# Altium schematic sheet 02_Power_Supply.SchDoc
size A4
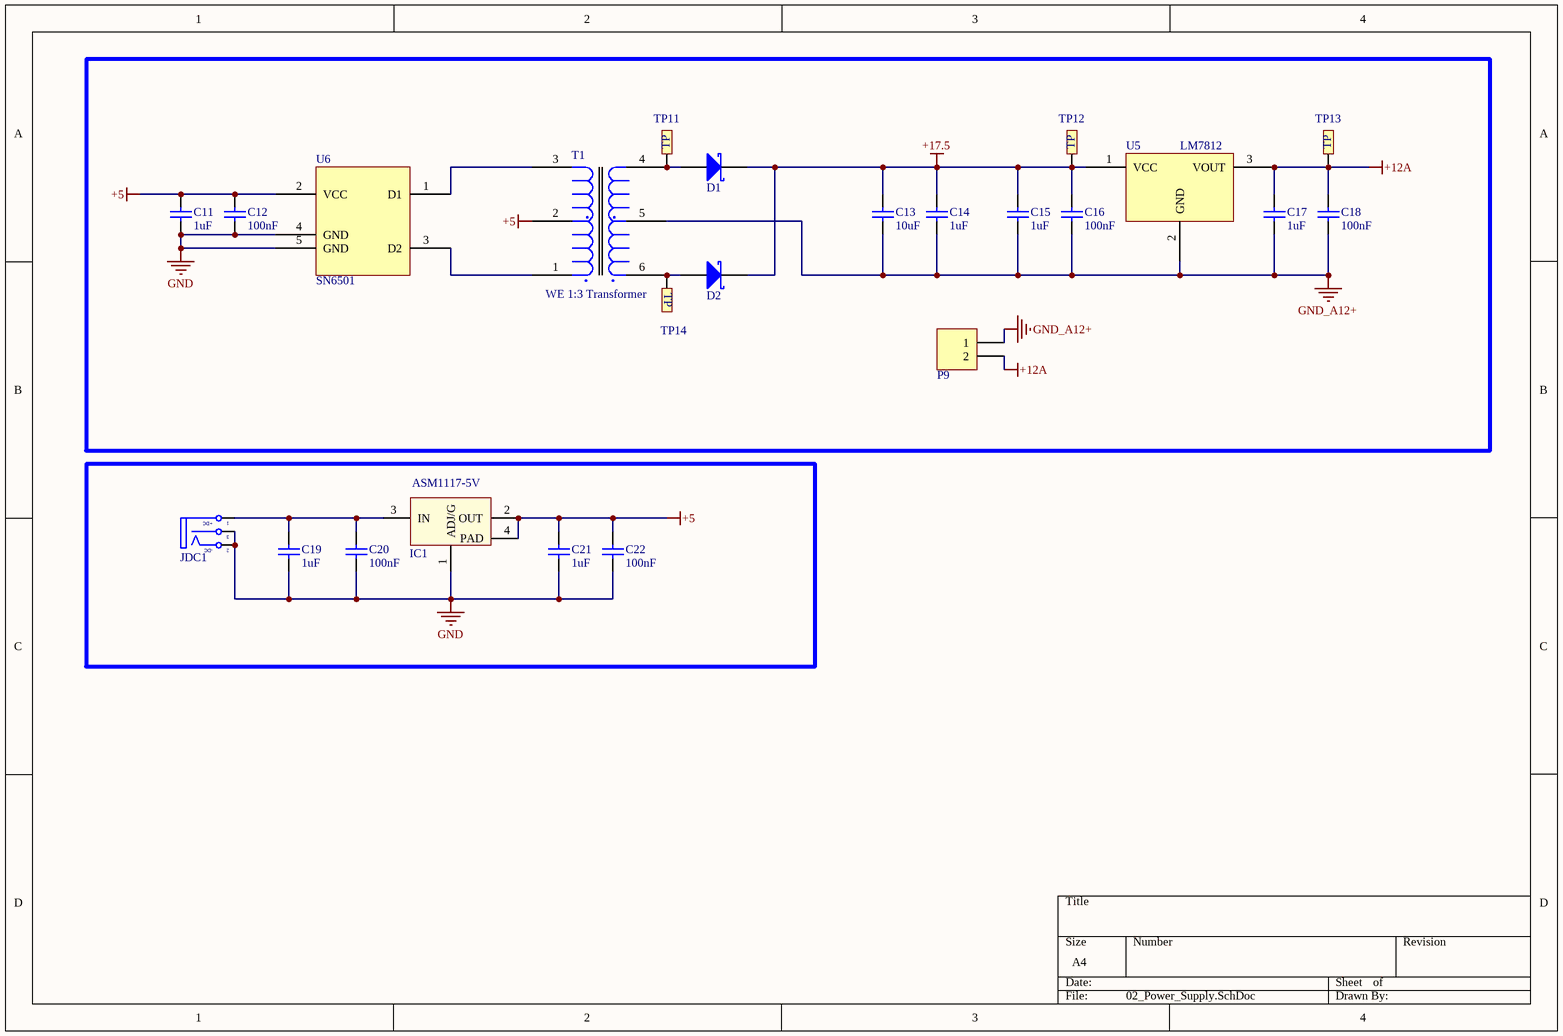
[diagram p0: 02_Power_Supply.SchDoc]

## Parts
C11  value 1uF  [CAP-SM-0805]  (hidden comment: Cap Non-Pol SMD)
C12  value 100nF  [CAP-SM-0805]  (hidden comment: Cap Non-Pol SMD)
C13  value 10uF  [CAP-SM-0805]  (hidden comment: Cap Non-Pol SMD)
C14  value 1uF  [CAP-SM-0805]  (hidden comment: Cap Non-Pol SMD)
C15  value 1uF  [CAP-SM-0805]  (hidden comment: Cap Non-Pol SMD)
C16  value 100nF  [CAP-SM-0805]  (hidden comment: Cap Non-Pol SMD)
C17  value 1uF  [CAP-SM-0805]  (hidden comment: Cap Non-Pol SMD)
C18  value 100nF  [CAP-SM-0805]  (hidden comment: Cap Non-Pol SMD)
C19  value 1uF  [CAP-SM-0805]  (hidden comment: Cap Non-Pol SMD)
C20  value 100nF  [CAP-SM-0805]  (hidden comment: Cap Non-Pol SMD)
C21  value 1uF  [CAP-SM-0805]  (hidden comment: Cap Non-Pol SMD)
C22  value 100nF  [CAP-SM-0805]  (hidden comment: Cap Non-Pol SMD)
D1  D Schottky  [SS34]  (value not drawn)
D2  D Schottky  [SS34]  (value not drawn)
IC1  ASM1117-5V  [SOT223-4N]
JDC1  Jack DC  [DC-IN]  (value not drawn)
P9  Domino 2  [DOMINO 2- 5mm]  (value not drawn)
T1  WE 1:3 Transformer  [750316818]
TP11  Test Point  [TP]  (value not drawn)
TP12  Test Point  [TP]  (value not drawn)
TP13  Test Point  [TP]  (value not drawn)
TP14  Test Point  [TP]  (value not drawn)
U5  LM7812  [DPAK228P1014X239-3N]
U6  SN6501  [SOT95P280X145-5N]

## Nets
+5: C11.2 C12.2 C21.2 C22.2 IC1.2(OUT) IC1.4(PAD) T1.2 U6.2(VCC)
+12A: C17.2 C18.2 P9.2 TP13.TP1 U5.3(VOUT)
+17.5: C13.2 C14.2 C15.2 C16.2 D1.2(K) D2.2(K) TP12.TP1 U5.1(VCC)
GND: C11.1 C12.1 C19.1 C20.1 C21.1 C22.1 IC1.1(ADJ/G) JDC1.2(TN) JDC1.3(S) U6.4(GND) U6.5(GND)
GND_A12+: C13.1 C14.1 C15.1 C16.1 C17.1 C18.1 P9.1 T1.5 U5.2(GND)
NetC19_2: C19.2 C20.2 IC1.3(IN) JDC1.1(T)
NetD1_1: D1.1(A) T1.4 TP11.TP1
NetD2_1: D2.1(A) T1.6 TP14.TP1
NetT1_1: T1.1 U6.3(D2)
NetT1_3: T1.3 U6.1(D1)

## Notes on the sheet
- (in symbol Jack DC) +DC; -DC
- (in symbol Test Point) TP

## Library data of the parts
C11-C22 = Cap Non-Pol SMD: Capacitor
D1 D2 = D Schottky: Schottky Diode; Published: 8-Jun-2000; LatestRevisionDate: 17-Jul-2002; LatestRevisionNote: Re-released for DXP Platform.; PackageReference: SMB; Publisher: Altium Limited; PackageDescription: DO-214-AA/SMB; 2 C-Bend Leads; Body 5.3 x 3.6 mm, inc. leads (LxW); Code_JEDEC: DO-214-AA
IC1 = LM1117: Available in 1.8V, 2.5V, 2.85V, 3.3V, 5V, and  Adjustable Versions; Value: LM317
JDC1 = Jack DC: Jack DC input; Value: Jac DC
P9 = Domino 2: Domino, 2-Pin; LatestRevisionDate: 17-Jul-2002; LatestRevisionNote: Re-released for DXP Platform.; Publisher: Altium Limited
T1 = WE 1:3.5 Transformer: Manufacturer: Wurth Elektronik; ComponentLink1Description: Supplier 1 Link; ComponentLink1URL: https://www.mouser.vn/ProductDetail/Wurth-Elektronik/750316818?qs=%2Fha2pyFaduhwWLO%2FwuaxPfkbn2Vm0sf%2F6JG8uX8izSO8%2FxDOwuQ00g%3D%3D; Manufacturer P/N: 750316818; Supplier 1: Mouser; Supplier 1 P/N: 710-750316818
U5 = LM78xx